# EAGLE design ScoutMakes Hall Sensor v1 (EAGLE 9.6.2)
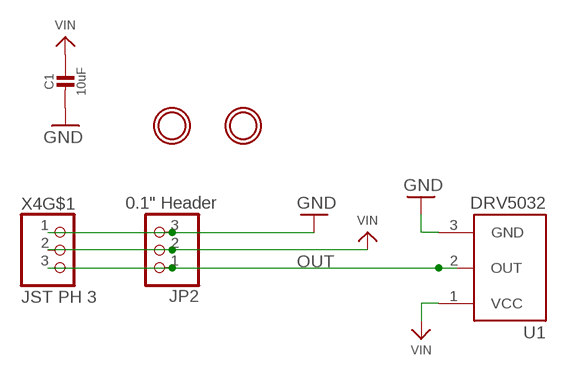
[diagram p0: schematic, sheet 1]

## Parts
C1  10uF  CAP_CERAMIC0805-NOOUTLINE  [0805-NO]
JP2  0.1" Header  HEADER-1X3ROUND  [1X03_ROUND]
U1  DRV5055A1QDBZT  [SOT95P237X112-3N]
U$1  MOUNTINGHOLE2.5  [MOUNTINGHOLE_2.5_PLATED]
U$8  MOUNTINGHOLE2.5  [MOUNTINGHOLE_2.5_PLATED]
X4  JST PH 3  CON_JST_PH_3PIN  [JSTPH3]

## Nets
GND: C1.2 JP2.3 U1.3(GND) X4.1
OUT: JP2.1 U1.2(OUT) X4.3
VIN: C1.1 JP2.2 U1.1(VCC) X4.2
Unconnected: X4.NC1(MT) X4.NC2(MT)

## Library data of the parts
C1 = microbuilder:CAP_CERAMIC: Ceramic Capacitors For new designs, use the packages preceded by an '_' character since they are more reliable: The following footprints should be used on most boards: _0402 - Standard footprint for regular board layouts _0603 - Standard footprint for regular board layouts _0805 - Standard footprint for regular board layouts _1206 - Standard footprint for regular board layouts For extremely tight-pitch boards where space is at a premium, the following 'micro-pitch' footprints can be used (smaller pads, no silkscreen outline, etc.): _0402MP - Micro-pitch footprint for very dense/compact boards _0603MP - Micro-pitch footprint for very dense/compact boards _0805MP - Micro-pitch footprint for very dense/compact boards _1206MP - Micro-pitch footprint for very dense/compact boards
JP2 = microbuilder:HEADER-1X3: PIN HEADER
U1 = DRV5055A1QDBZT:DRV5055A1QDBZT: High Accuracy 3.3 V or 5 V Ratiometric Bipolar Hall Effect Sensor Family 3-SOT-23 -40 to 125 Check availability <https://pricing.snapeda.com/parts/DRV5055A1QDBZT/Texas%20Instruments/view-part?ref=eda>; AVAILABILITY: In Stock; CHECK_PRICES: https://www.snapeda.com/parts/DRV5055A1QDBZT/Texas+Instruments/view-part/?ref=eda; DESCRIPTION: Ratiometric linear hall effect sensor with analog output; MF: Texas Instruments; MP: DRV5032; PACKAGE: SOT-23-3 Texas Instruments; PRICE: None; PURCHASE-URL: https://www.snapeda.com/api/url_track_click_mouser/?unipart_id=2777465&manufacturer=Texas Instruments&part_name=DRV5055A1QDBZT&search_term=drv5055; SNAPEDA_LINK: https://www.snapeda.com/parts/DRV5055A1QDBZT/Texas+Instruments/view-part/?ref=snap
U$1 U$8 = adafruit_electromech:MOUNTINGHOLE: Mounting Hole For #2 screws (0.086"/2.18mm width, 0.094"/2.4mm hole) use 2.5mm; BOM: EXCLUDE
X4 = adafruit_electromech:CON_JST_PH_3PIN

## Net classes
1 HV: width 0.406 mm, drill 0.381 mm, clearance 0.762 mm

## Board
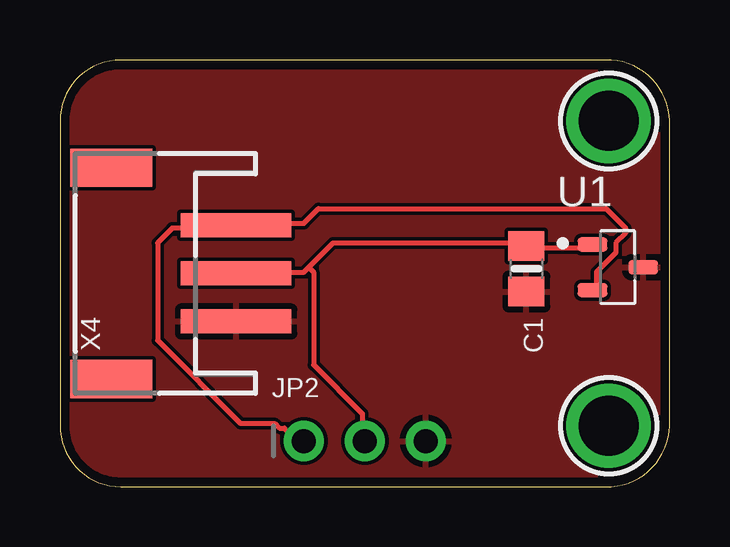
[diagram p1: board, top side]
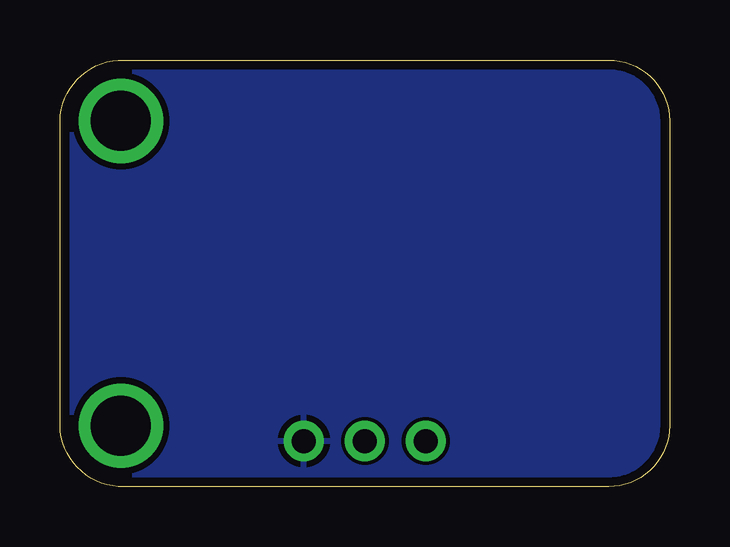
[diagram p2: board, bottom side, seen from below]

Size 25.4 x 17.78 mm. Coordinates in mm from the lower left corner, seen from the top.
Outline: 0,15.24 0,2.54 arc90 2.54,0 22.73,0 arc90 25.4,2.54 25.4,15.24 arc90 22.73,17.78 2.54,17.78 arc90 0,15.24
Copper layers (1*16): Top 0.035559375mm / dielectric 1.6mm / Bottom 0.035559375mm
Design rules "oshpark-2layer *": minimum track width 6mil, minimum drill 10mil, track to track 6mil, track to pad 6mil, pad to pad 6mil, via to via 6mil, smd to smd 6mil, copper to edge 15mil, drill to drill 6mil, minimum pad ring 5mil, minimum via ring 5mil, stop-mask expansion 2.5mil, vias tented up to drill 20mil, thermal gap 10mil

### Footprints (pad centres in the part's own frame; a part is rotated, then mirrored left to right if it is on the bottom)
0805-NO = smd 1.24 x 1.5: 1 -0.95,0; 2 0.95,0
1X03_ROUND = drill 1 pad 1.676: 1 -2.54,0; 2 0,0; 3 2.54,0
SOT95P237X112-3N = smd 1.24 x 0.59: 1 -1.055,0.95; 2 -1.055,-0.95; 3 1.055,0
MOUNTINGHOLE_2.5_PLATED = drill 2.5 pad 3.2: P$1 0,0
JSTPH3 = smd 1 x 4.6: 1 -2,-2.7; 2 0,-2.7; 3 2,-2.7 | smd 1.6 x 3.4: NC1 -4.4,2.5; NC2 4.4,2.5

### Placement (x,y rotation side)
C1  19.43,9.08 270 top
JP2  12.7,1.91 0 top
U1  23.24,9.14 0 top
U$1  22.86,2.54 0 top
U$8  22.86,15.24 0 top
X4  4.64,8.89 90 top

### Tracks (layer width: path | path; a pad name or v marks a point on that pad's centre or on a via)
GND
  pour Top: 0,17.78 25.4,17.78 25.4,0 0,0
  pour Bottom: 0,17.78 25.4,17.78 25.4,0 0,0
OUT
  Top 0.203: U1.2 22.35,8.33 22.35,8.94 23.16,9.75 23.16,10.16 23.57,10.57 23.57,10.77 22.76,11.58 10.77,11.58 10.16,10.97 7.52,10.97 X4.3 7.32,10.77 4.67,10.77 4.06,10.16 4.06,6.1 7.52,2.64 8.94,2.64 9.14,2.44 9.35,2.44 9.75,2.03 10.16,2.03 JP2.1
VIN
  Top 0.203: U1.1 22.15,9.96 19.51,9.96 C1.1 19.3,10.16 11.38,10.16 10.36,9.14 | 10.36,9.14 10.16,8.94 7.52,8.94 X4.2 | 10.36,9.14 10.57,8.94 10.57,5.08 12.6,3.05 12.6,2.03 JP2.2

### Text on the board
Pinguin_tPlace: OMNIPOLAR / DIGITAL HALL / SENSOR | C1 | U1 | OUT | VIN | GND
Pinguin_bPlace: SCOUTMAKES / HALL EFFECT / SENSOR / DRV5032 | VIN / 1.65V-5.5V | VIN | OUT | GND